# EAGLE schematic logicanalyzer_rev1 (EAGLE 4.16)

## Sheet 1 of 4
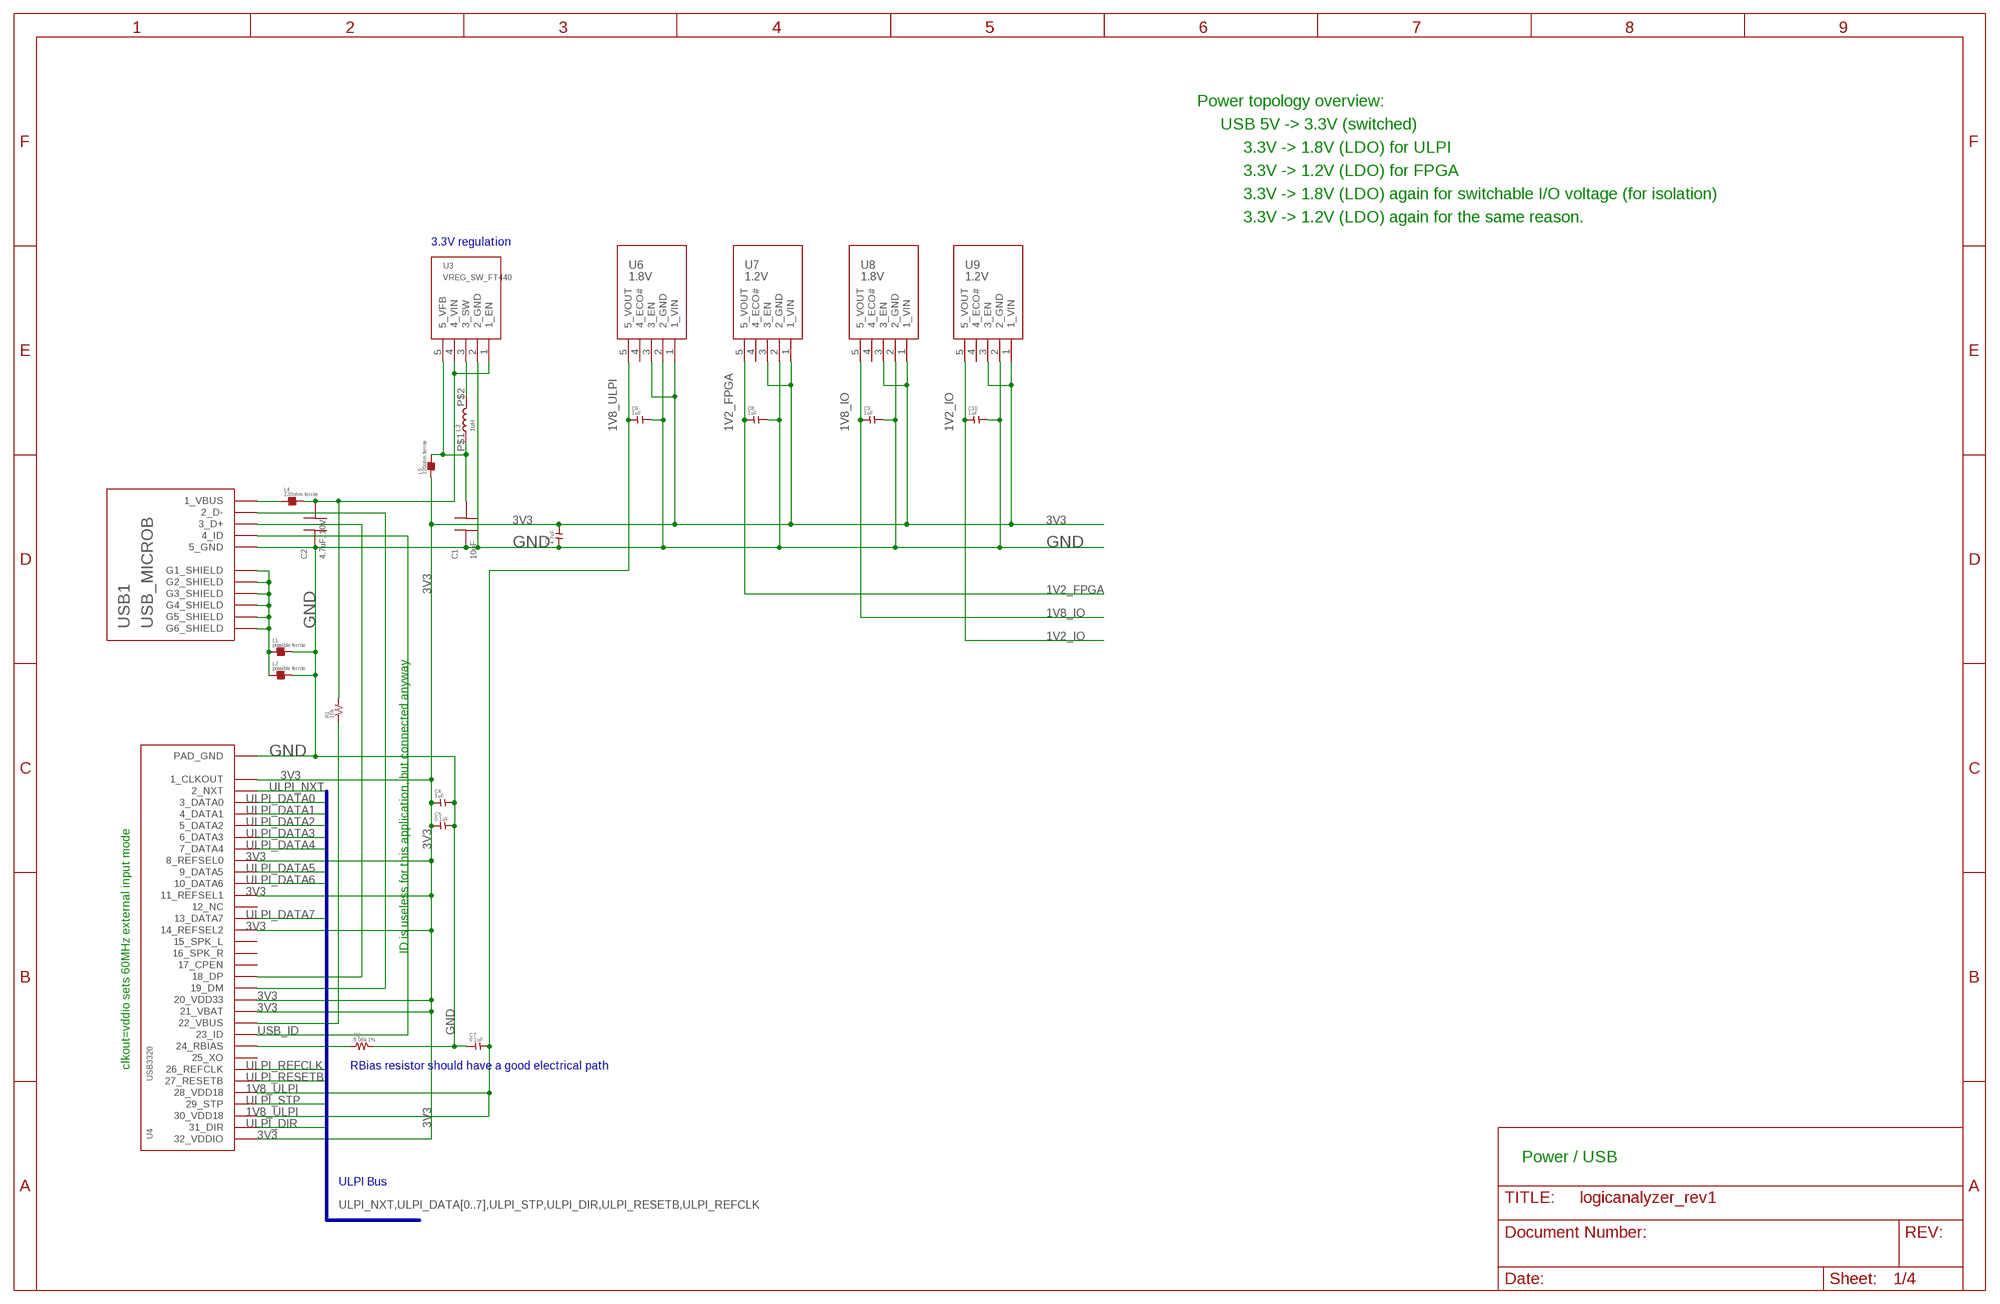
[diagram p0: schematic, sheet 1]

### Parts
C1  10uF  CAP0805  [SMD0805]
C2  4.7uF, 10V  CAP0805  [SMD0805]
C3  4.7uF  CAP0603  [0603]
C4  1uF  CAP0603  [0603]
C5  0.1uF  CAP0603  [0603]
C6  1uF  CAP0603  [0603]
C7  0.1uF  CAP0603  [0603]
C8  1uF  CAP0603  [0603]
C9  1uF  CAP0603  [0603]
C10  1uF  CAP0603  [0603]
L1  possible ferrite  FERRITE0603  [0603]
L2  possible ferrite  FERRITE0603  [0603]
L3  1uH  L_0805  [SMD0805]
L4  220ohm ferrite  FERRITE0603  [0603]
L5  220ohm ferrite  FERRITE0603  [0603]
R1  10k  RES0603  [0603]
R2  8.06k 1%  RES0603  [0603]
U3  VREG_SW_FT440  [SOT-23-5]
U4  USB3320  [QFG32PAD_.5MM_5X5]
U6  1.8V  VREG_LDO  [SOT-23-5]
U7  1.2V  VREG_LDO  [SOT-23-5]
U8  1.8V  VREG_LDO  [SOT-23-5]
U9  1.2V  VREG_LDO  [SOT-23-5]
USB1  USB_MICROB  [USB_MICROB_FEMALE_FCI_10103594]

### Nets
1V2_FPGA: C8.1 U7.5(5_VOUT) ; also sheet 3,4
1V2_IO: C10.1 U9.5(5_VOUT) ; also sheet 2
1V8_IO: C9.1 U8.5(5_VOUT) ; also sheet 2,4
1V8_ULPI: C6.1 C7.2 U4.28(28_VDD18) U4.30(30_VDD18) U6.5(5_VOUT)
3V3: C3.2 C4.1 C5.1 L5.1 U4.1(1_CLKOUT) U4.8(8_REFSEL0) U4.11(11_REFSEL1) U4.14(14_REFSEL2) U4.20(20_VDD33) U4.21(21_VBAT) U4.32(32_VDDIO) U6.1(1_VIN) U6.3(3_EN) U7.1(1_VIN) U7.3(3_EN) U8.1(1_VIN) U8.3(3_EN) U9.1(1_VIN) U9.3(3_EN) ; also sheet 2,3,4
GND: C1.P$1 C2.P$1 C3.1 C4.2 C5.2 C6.2 C7.1 C8.2 C9.2 C10.2 L1.2 L2.2 R2.2 U3.2(2_GND) U4.PAD(PAD_GND) U6.2(2_GND) U7.2(2_GND) U8.2(2_GND) U9.2(2_GND) USB1.5(5_GND) ; also sheet 2,3,4
N$1: L1.1 L2.1 USB1.G1(G1_SHIELD) USB1.G2(G2_SHIELD) USB1.G3(G3_SHIELD) USB1.G4(G4_SHIELD) USB1.G5(G5_SHIELD) USB1.G6(G6_SHIELD)
N$2: C2.P$2 L4.2 R1.2 U3.1(1_EN) U3.4(4_VIN)
N$3: U4.18(18_DP) USB1.3(3_D+)
N$4: U4.19(19_DM) USB1.2(2_D-)
N$5: R1.1 U4.22(22_VBUS)
N$6: L3.P$2 U3.3(3_SW)
N$7: L4.1 USB1.1(1_VBUS)
N$8: R2.1 U4.24(24_RBIAS)
N$9: C1.P$2 L3.P$1 L5.2 U3.5(5_VFB)
ULPI_DATA0: U4.3(3_DATA0) ; also sheet 4
ULPI_DATA1: U4.4(4_DATA1) ; also sheet 4
ULPI_DATA2: U4.5(5_DATA2) ; also sheet 4
ULPI_DATA3: U4.6(6_DATA3) ; also sheet 4
ULPI_DATA4: U4.7(7_DATA4) ; also sheet 4
ULPI_DATA5: U4.9(9_DATA5) ; also sheet 4
ULPI_DATA6: U4.10(10_DATA6) ; also sheet 4
ULPI_DATA7: U4.13(13_DATA7) ; also sheet 4
ULPI_DIR: U4.31(31_DIR) ; also sheet 4
ULPI_NXT: U4.2(2_NXT) ; also sheet 4
ULPI_REFCLK: U4.26(26_REFCLK) ; also sheet 4
ULPI_RESETB: U4.27(27_RESETB) ; also sheet 4
ULPI_STP: U4.29(29_STP) ; also sheet 4
USB_ID: U4.23(23_ID) USB1.4(4_ID)
Unconnected: U4.12(12_NC) U4.15(15_SPK_L) U4.16(16_SPK_R) U4.17(17_CPEN) U4.25(25_XO) U6.4(4_ECO#) U7.4(4_ECO#) U8.4(4_ECO#) U9.4(4_ECO#)

### Buses
ULPI_NXT,ULPI_DATA[0..7],ULPI_STP,ULPI_DIR,ULPI_RESETB,ULPI_REFCLK

### Notes on the sheet
- Power topology overview:
- USB 5V -> 3.3V (switched)
- 3.3V -> 1.8V (LDO) for ULPI
- 3.3V -> 1.2V (LDO) for FPGA
- 3.3V -> 1.8V (LDO) again for switchable I/O voltage (for isolation)
- 3.3V -> 1.2V (LDO) again for the same reason.
- 3.3V regulation
- ID is useless for this application, but connected anyway
- clkout=vddio sets 60MHz external input mode | RBias resistor should have a good electrical path
- Power / USB
- ULPI Bus

## Sheet 2 of 4
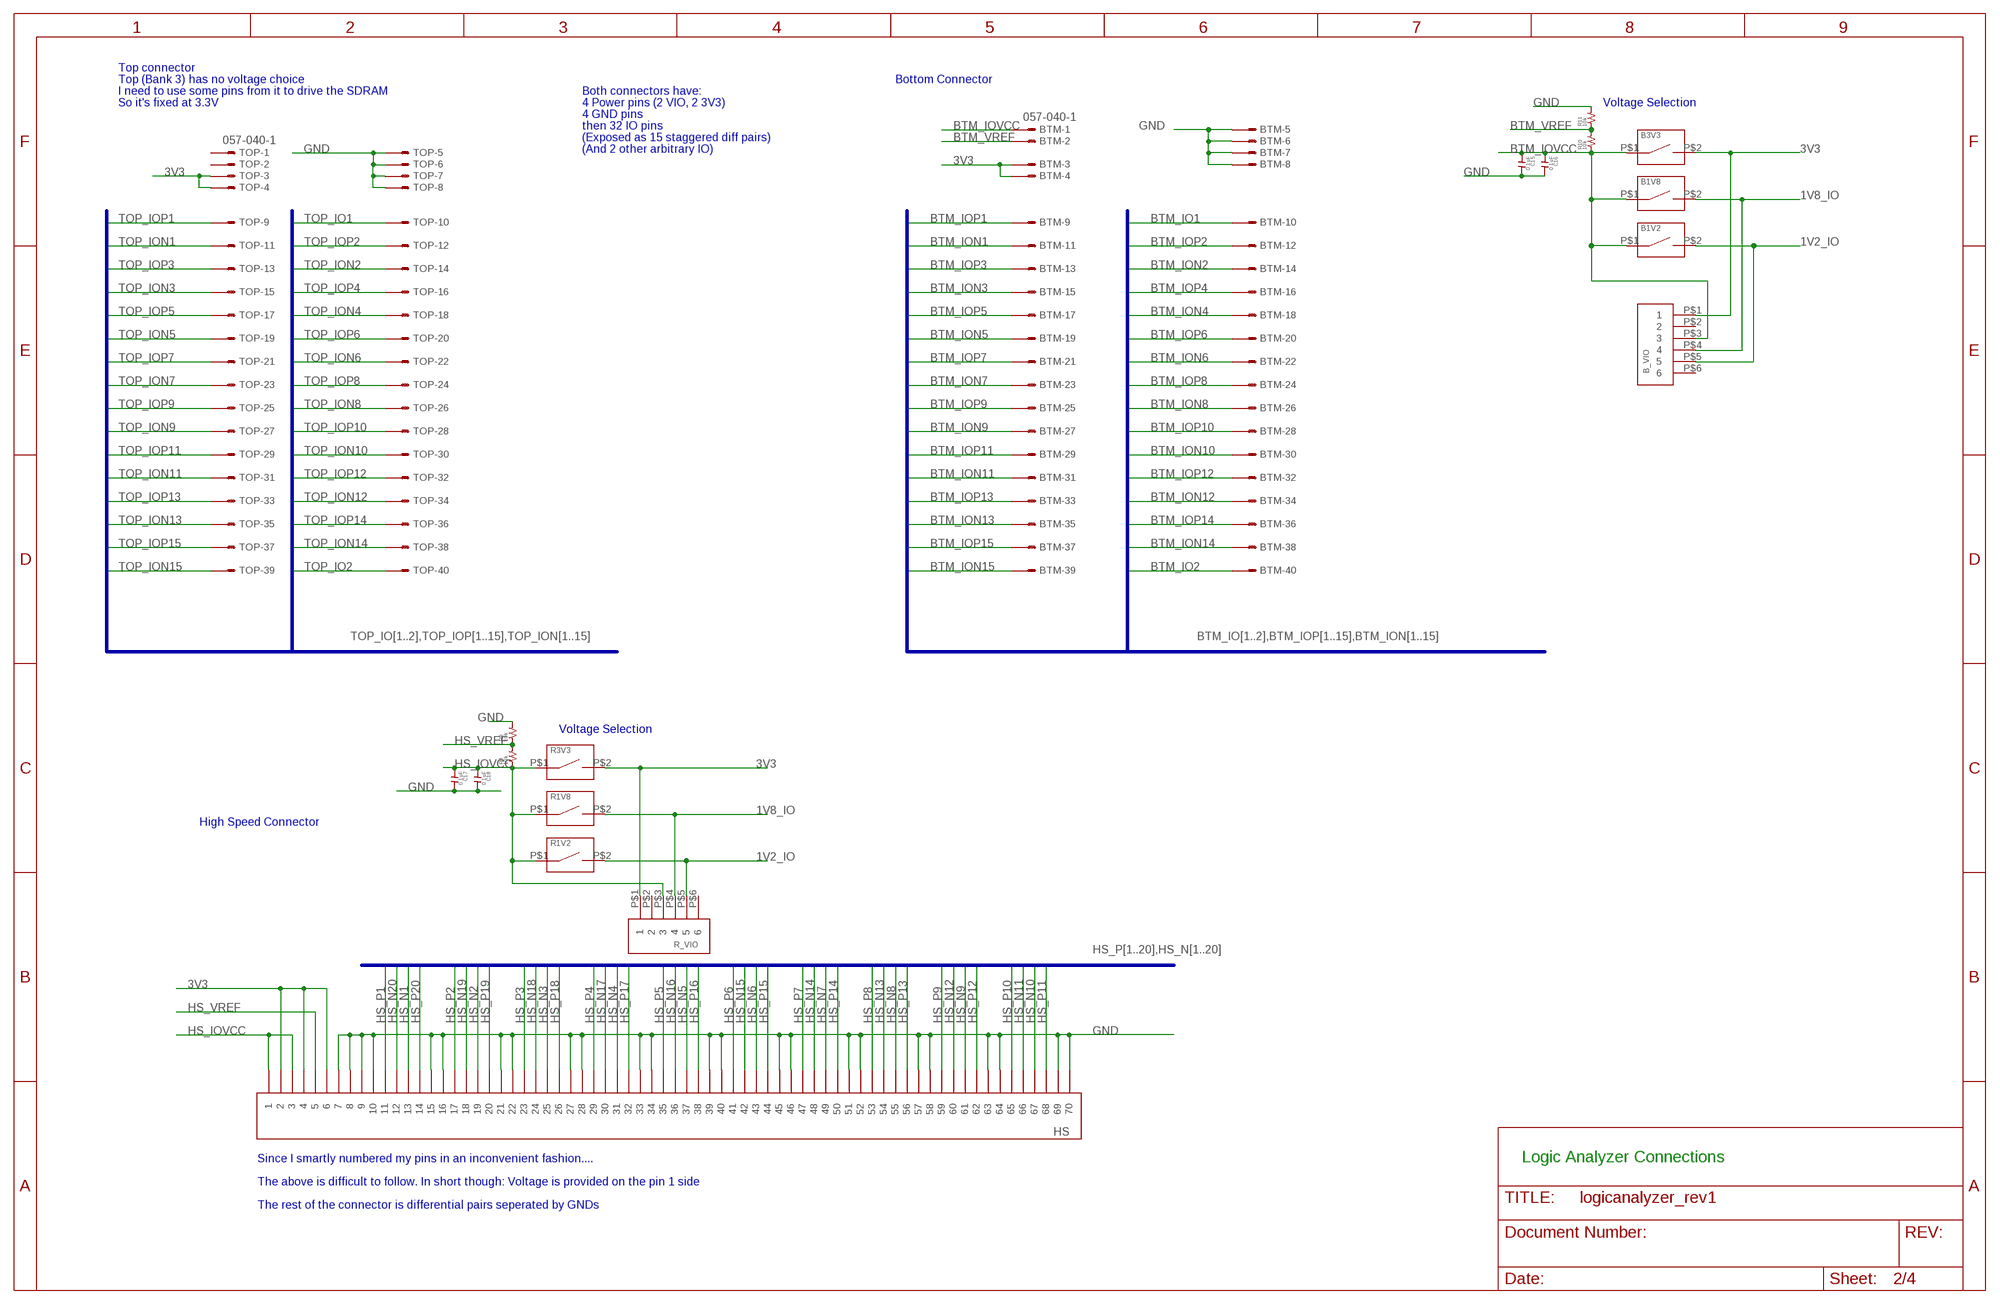
[diagram p1: schematic, sheet 2]

### Parts
B1V2  JUMPER2  [JUMPERPAD2]
B1V8  JUMPER2  [JUMPERPAD2]
B3V3  JUMPER2  [JUMPERPAD2]
B_VIO  HEADER_3X2  [HEADER_3X2]
BTM  057-040-1  [057-040-1]
C15  0.1uF  CAP0603  [0603]
C16  0.1uF  CAP0603  [0603]
C17  0.1uF  CAP0603  [0603]
C18  0.1uF  CAP0603  [0603]
HS  DF40_70BTM  [DF40_70_BTM]
R1V2  JUMPER2  [JUMPERPAD2]
R1V8  JUMPER2  [JUMPERPAD2]
R3V3  JUMPER2  [JUMPERPAD2]
R8  10k  RES0603  [0603]
R9  10k  RES0603  [0603]
R10  10k  RES0603  [0603]
R11  10k  RES0603  [0603]
R_VIO  HEADER_3X2  [HEADER_3X2]
TOP  057-040-1  [057-040-1]

### Nets
1V2_IO: B1V2.P$2 B_VIO.P$5 R1V2.P$2 R_VIO.P$5 ; also sheet 1
1V8_IO: B1V8.P$2 B_VIO.P$4 R1V8.P$2 R_VIO.P$4 ; also sheet 1,4
3V3: B3V3.P$2 B_VIO.P$1 BTM.3 BTM.4 HS.P$2 HS.P$4 HS.P$6 R3V3.P$2 R_VIO.P$1 TOP.3 TOP.4 ; also sheet 1,3,4
BTM_IO1: BTM.10 ; also sheet 4
BTM_IO2: BTM.40 ; also sheet 4
BTM_ION1: BTM.11 ; also sheet 4
BTM_ION2: BTM.14 ; also sheet 4
BTM_ION3: BTM.15 ; also sheet 4
BTM_ION4: BTM.18 ; also sheet 4
BTM_ION5: BTM.19 ; also sheet 4
BTM_ION6: BTM.22 ; also sheet 4
BTM_ION7: BTM.23 ; also sheet 4
BTM_ION8: BTM.26 ; also sheet 4
BTM_ION9: BTM.27 ; also sheet 4
BTM_ION10: BTM.30 ; also sheet 4
BTM_ION11: BTM.31 ; also sheet 4
BTM_ION12: BTM.34 ; also sheet 4
BTM_ION13: BTM.35 ; also sheet 4
BTM_ION14: BTM.38 ; also sheet 4
BTM_ION15: BTM.39 ; also sheet 4
BTM_IOP1: BTM.9 ; also sheet 4
BTM_IOP2: BTM.12 ; also sheet 4
BTM_IOP3: BTM.13 ; also sheet 4
BTM_IOP4: BTM.16 ; also sheet 4
BTM_IOP5: BTM.17 ; also sheet 4
BTM_IOP6: BTM.20 ; also sheet 4
BTM_IOP7: BTM.21 ; also sheet 4
BTM_IOP8: BTM.24 ; also sheet 4
BTM_IOP9: BTM.25 ; also sheet 4
BTM_IOP10: BTM.28 ; also sheet 4
BTM_IOP11: BTM.29 ; also sheet 4
BTM_IOP12: BTM.32 ; also sheet 4
BTM_IOP13: BTM.33 ; also sheet 4
BTM_IOP14: BTM.36 ; also sheet 4
BTM_IOP15: BTM.37 ; also sheet 4
BTM_IOVCC: B1V2.P$1 B1V8.P$1 B3V3.P$1 B_VIO.P$3 BTM.1 C15.1 C16.1 R10.1 ; also sheet 4
BTM_VREF: BTM.2 R10.2 R11.1 ; also sheet 4
GND: BTM.5 BTM.6 BTM.7 BTM.8 C15.2 C16.2 C17.2 C18.2 HS.P$7 HS.P$8 HS.P$9 HS.P$10 HS.P$15 HS.P$16 HS.P$21 HS.P$22 HS.P$27 HS.P$28 HS.P$33 HS.P$34 HS.P$39 HS.P$40 HS.P$45 HS.P$46 HS.P$51 HS.P$52 HS.P$57 HS.P$58 HS.P$63 HS.P$64 HS.P$69 HS.P$70 R9.2 R11.2 TOP.5 TOP.6 TOP.7 TOP.8 ; also sheet 1,3,4
HS_IOVCC: C17.1 C18.1 HS.P$1 HS.P$3 R1V2.P$1 R1V8.P$1 R3V3.P$1 R8.1 R_VIO.P$3 ; also sheet 4
HS_N1: HS.P$13 ; also sheet 4
HS_N2: HS.P$19 ; also sheet 4
HS_N3: HS.P$25 ; also sheet 4
HS_N4: HS.P$31 ; also sheet 4
HS_N5: HS.P$37 ; also sheet 4
HS_N6: HS.P$43 ; also sheet 4
HS_N7: HS.P$49 ; also sheet 4
HS_N8: HS.P$55 ; also sheet 4
HS_N9: HS.P$61 ; also sheet 4
HS_N10: HS.P$67 ; also sheet 4
HS_N11: HS.P$66 ; also sheet 4
HS_N12: HS.P$60 ; also sheet 4
HS_N13: HS.P$54 ; also sheet 4
HS_N14: HS.P$48 ; also sheet 4
HS_N15: HS.P$42 ; also sheet 4
HS_N16: HS.P$36 ; also sheet 4
HS_N17: HS.P$30 ; also sheet 4
HS_N18: HS.P$24 ; also sheet 4
HS_N19: HS.P$18
HS_N20: HS.P$12
HS_P1: HS.P$11 ; also sheet 4
HS_P2: HS.P$17 ; also sheet 4
HS_P3: HS.P$23 ; also sheet 4
HS_P4: HS.P$29 ; also sheet 4
HS_P5: HS.P$35 ; also sheet 4
HS_P6: HS.P$41 ; also sheet 4
HS_P7: HS.P$47 ; also sheet 4
HS_P8: HS.P$53 ; also sheet 4
HS_P9: HS.P$59 ; also sheet 4
HS_P10: HS.P$65 ; also sheet 4
HS_P11: HS.P$68 ; also sheet 4
HS_P12: HS.P$62 ; also sheet 4
HS_P13: HS.P$56 ; also sheet 4
HS_P14: HS.P$50 ; also sheet 4
HS_P15: HS.P$44 ; also sheet 4
HS_P16: HS.P$38 ; also sheet 4
HS_P17: HS.P$32 ; also sheet 4
HS_P18: HS.P$26 ; also sheet 4
HS_P19: HS.P$20 ; also sheet 4
HS_P20: HS.P$14
HS_VREF: HS.P$5 R8.2 R9.1 ; also sheet 4
TOP_IO1: TOP.10 ; also sheet 4
TOP_IO2: TOP.40 ; also sheet 4
TOP_ION1: TOP.11 ; also sheet 4
TOP_ION2: TOP.14 ; also sheet 4
TOP_ION3: TOP.15 ; also sheet 4
TOP_ION4: TOP.18 ; also sheet 4
TOP_ION5: TOP.19 ; also sheet 4
TOP_ION6: TOP.22 ; also sheet 4
TOP_ION7: TOP.23 ; also sheet 4
TOP_ION8: TOP.26 ; also sheet 4
TOP_ION9: TOP.27 ; also sheet 4
TOP_ION10: TOP.30 ; also sheet 4
TOP_ION11: TOP.31 ; also sheet 4
TOP_ION12: TOP.34 ; also sheet 4
TOP_ION13: TOP.35 ; also sheet 4
TOP_ION14: TOP.38 ; also sheet 4
TOP_ION15: TOP.39 ; also sheet 4
TOP_IOP1: TOP.9 ; also sheet 4
TOP_IOP2: TOP.12 ; also sheet 4
TOP_IOP3: TOP.13 ; also sheet 4
TOP_IOP4: TOP.16 ; also sheet 4
TOP_IOP5: TOP.17 ; also sheet 4
TOP_IOP6: TOP.20 ; also sheet 4
TOP_IOP7: TOP.21 ; also sheet 4
TOP_IOP8: TOP.24 ; also sheet 4
TOP_IOP9: TOP.25 ; also sheet 4
TOP_IOP10: TOP.28 ; also sheet 4
TOP_IOP11: TOP.29 ; also sheet 4
TOP_IOP12: TOP.32 ; also sheet 4
TOP_IOP13: TOP.33 ; also sheet 4
TOP_IOP14: TOP.36 ; also sheet 4
TOP_IOP15: TOP.37 ; also sheet 4
Unconnected: B_VIO.P$2 B_VIO.P$6 R_VIO.P$2 R_VIO.P$6 TOP.1 TOP.2

### Buses
TOP_IO[1..2],TOP_IOP[1..15],TOP_ION[1..15]
BTM_IO[1..2],BTM_IOP[1..15],BTM_ION[1..15]
HS_P[1..20],HS_N[1..20]

### Notes on the sheet
- Top connector
- Top (Bank 3) has no voltage choice | Bottom Connector
- I need to use some pins from it to drive the SDRAM | Both connectors have:
- So it's fixed at 3.3V | 4 Power pins (2 VIO, 2 3V3) | Voltage Selection
- 4 GND pins
- then 32 IO pins
- (Exposed as 15 staggered diff pairs)
- (And 2 other arbitrary IO)
- Voltage Selection
- High Speed Connector
- Since I smartly numbered my pins in an inconvenient fashion.... | Logic Analyzer Connections
- The above is difficult to follow. In short though: Voltage is provided on the pin 1 side
- The rest of the connector is differential pairs seperated by GNDs

## Sheet 3 of 4
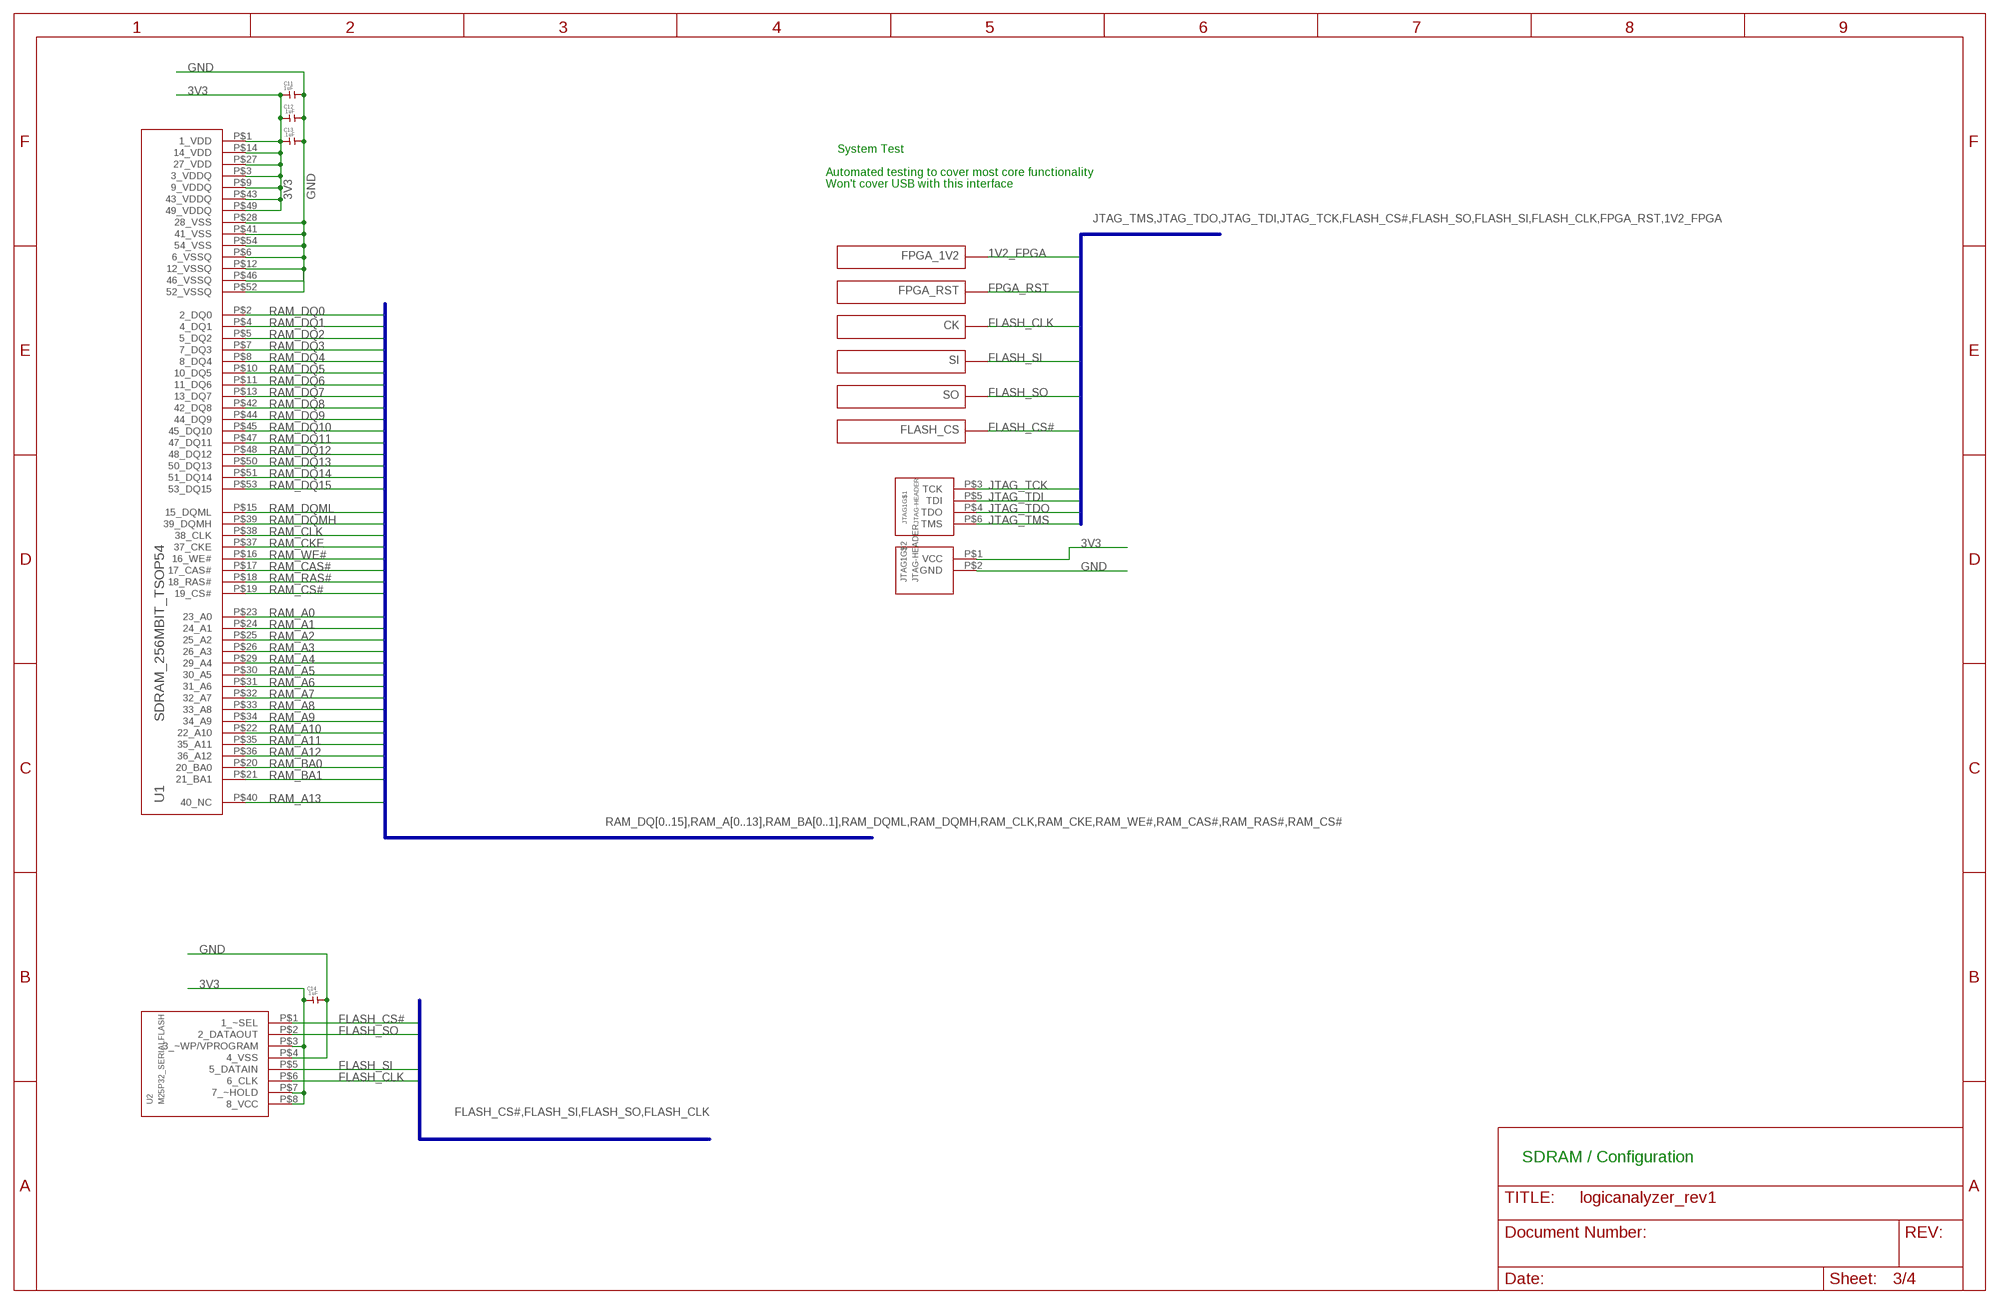
[diagram p2: schematic, sheet 3]

### Parts
C11  1uF  CAP0603  [0603]
C12  .1uF  CAP0603  [0603]
C13  .1uF  CAP0603  [0603]
C14  .1uF  CAP0603  [0603]
CK  PIN1.0MM  [PIN_1.0MM]
FLASH_CS  PIN1.0MM  [PIN_1.0MM]
FPGA_1V2  PIN1.0MM  [PIN_1.0MM]
FPGA_RST  PIN1.0MM  [PIN_1.0MM]
JTAG1  JTAG-HEADER  [JTAGHEADER6X1]
SI  PIN1.0MM  [PIN_1.0MM]
SO  PIN1.0MM  [PIN_1.0MM]
U1  SDRAM_256MBIT_TSOP54  [TSOP54_0.8MM_12X22]
U2  M25P32_SERIALFLASH  [SOIC-8-5.3MM]

### Nets
1V2_FPGA: FPGA_1V2.P$1 ; also sheet 1,4
3V3: C11.1 C12.1 C13.1 C14.1 JTAG1.P$1(VCC) U1.P$1(1_VDD) U1.P$3(3_VDDQ) U1.P$9(9_VDDQ) U1.P$14(14_VDD) U1.P$27(27_VDD) U1.P$43(43_VDDQ) U1.P$49(49_VDDQ) U2.P$3(3_~WP/VPROGRAM) U2.P$7(7_~HOLD) U2.P$8(8_VCC) ; also sheet 1,2,4
FLASH_CLK: CK.P$1 U2.P$6(6_CLK) ; also sheet 4
FLASH_CS#: FLASH_CS.P$1 U2.P$1(1_~SEL) ; also sheet 4
FLASH_SI: SI.P$1 U2.P$5(5_DATAIN) ; also sheet 4
FLASH_SO: SO.P$1 U2.P$2(2_DATAOUT) ; also sheet 4
FPGA_RST: FPGA_RST.P$1 ; also sheet 4
GND: C11.2 C12.2 C13.2 C14.2 JTAG1.P$2(GND) U1.P$6(6_VSSQ) U1.P$12(12_VSSQ) U1.P$28(28_VSS) U1.P$41(41_VSS) U1.P$46(46_VSSQ) U1.P$52(52_VSSQ) U1.P$54(54_VSS) U2.P$4(4_VSS) ; also sheet 1,2,4
JTAG_TCK: JTAG1.P$3(TCK) ; also sheet 4
JTAG_TDI: JTAG1.P$5(TDI) ; also sheet 4
JTAG_TDO: JTAG1.P$4(TDO) ; also sheet 4
JTAG_TMS: JTAG1.P$6(TMS) ; also sheet 4
RAM_A0: U1.P$23(23_A0) ; also sheet 4
RAM_A1: U1.P$24(24_A1) ; also sheet 4
RAM_A2: U1.P$25(25_A2) ; also sheet 4
RAM_A3: U1.P$26(26_A3) ; also sheet 4
RAM_A4: U1.P$29(29_A4) ; also sheet 4
RAM_A5: U1.P$30(30_A5) ; also sheet 4
RAM_A6: U1.P$31(31_A6) ; also sheet 4
RAM_A7: U1.P$32(32_A7) ; also sheet 4
RAM_A8: U1.P$33(33_A8) ; also sheet 4
RAM_A9: U1.P$34(34_A9) ; also sheet 4
RAM_A10: U1.P$22(22_A10) ; also sheet 4
RAM_A11: U1.P$35(35_A11) ; also sheet 4
RAM_A12: U1.P$36(36_A12) ; also sheet 4
RAM_A13: U1.P$40(40_NC) ; also sheet 4
RAM_BA0: U1.P$20(20_BA0) ; also sheet 4
RAM_BA1: U1.P$21(21_BA1) ; also sheet 4
RAM_CAS#: U1.P$17(17_CAS#) ; also sheet 4
RAM_CKE: U1.P$37(37_CKE) ; also sheet 4
RAM_CLK: U1.P$38(38_CLK) ; also sheet 4
RAM_CS#: U1.P$19(19_CS#) ; also sheet 4
RAM_DQ0: U1.P$2(2_DQ0) ; also sheet 4
RAM_DQ1: U1.P$4(4_DQ1) ; also sheet 4
RAM_DQ2: U1.P$5(5_DQ2) ; also sheet 4
RAM_DQ3: U1.P$7(7_DQ3) ; also sheet 4
RAM_DQ4: U1.P$8(8_DQ4) ; also sheet 4
RAM_DQ5: U1.P$10(10_DQ5) ; also sheet 4
RAM_DQ6: U1.P$11(11_DQ6) ; also sheet 4
RAM_DQ7: U1.P$13(13_DQ7) ; also sheet 4
RAM_DQ8: U1.P$42(42_DQ8) ; also sheet 4
RAM_DQ9: U1.P$44(44_DQ9) ; also sheet 4
RAM_DQ10: U1.P$45(45_DQ10) ; also sheet 4
RAM_DQ11: U1.P$47(47_DQ11) ; also sheet 4
RAM_DQ12: U1.P$48(48_DQ12) ; also sheet 4
RAM_DQ13: U1.P$50(50_DQ13) ; also sheet 4
RAM_DQ14: U1.P$51(51_DQ14) ; also sheet 4
RAM_DQ15: U1.P$53(53_DQ15) ; also sheet 4
RAM_DQMH: U1.P$39(39_DQMH) ; also sheet 4
RAM_DQML: U1.P$15(15_DQML) ; also sheet 4
RAM_RAS#: U1.P$18(18_RAS#) ; also sheet 4
RAM_WE#: U1.P$16(16_WE#) ; also sheet 4

### Buses
RAM_DQ[0..15],RAM_A[0..13],RAM_BA[0..1],RAM_DQML,RAM_DQMH,RAM_CLK,RAM_CKE,RAM_WE#,RAM_CAS#,RAM_RAS#,RAM_CS#
FLASH_CS#,FLASH_SI,FLASH_SO,FLASH_CLK
JTAG_TMS,JTAG_TDO,JTAG_TDI,JTAG_TCK,FLASH_CS#,FLASH_SO,FLASH_SI,FLASH_CLK,FPGA_RST,1V2_FPGA

### Notes on the sheet
- System Test
- Automated testing to cover most core functionality
- Won't cover USB with this interface
- SDRAM / Configuration

## Sheet 4 of 4
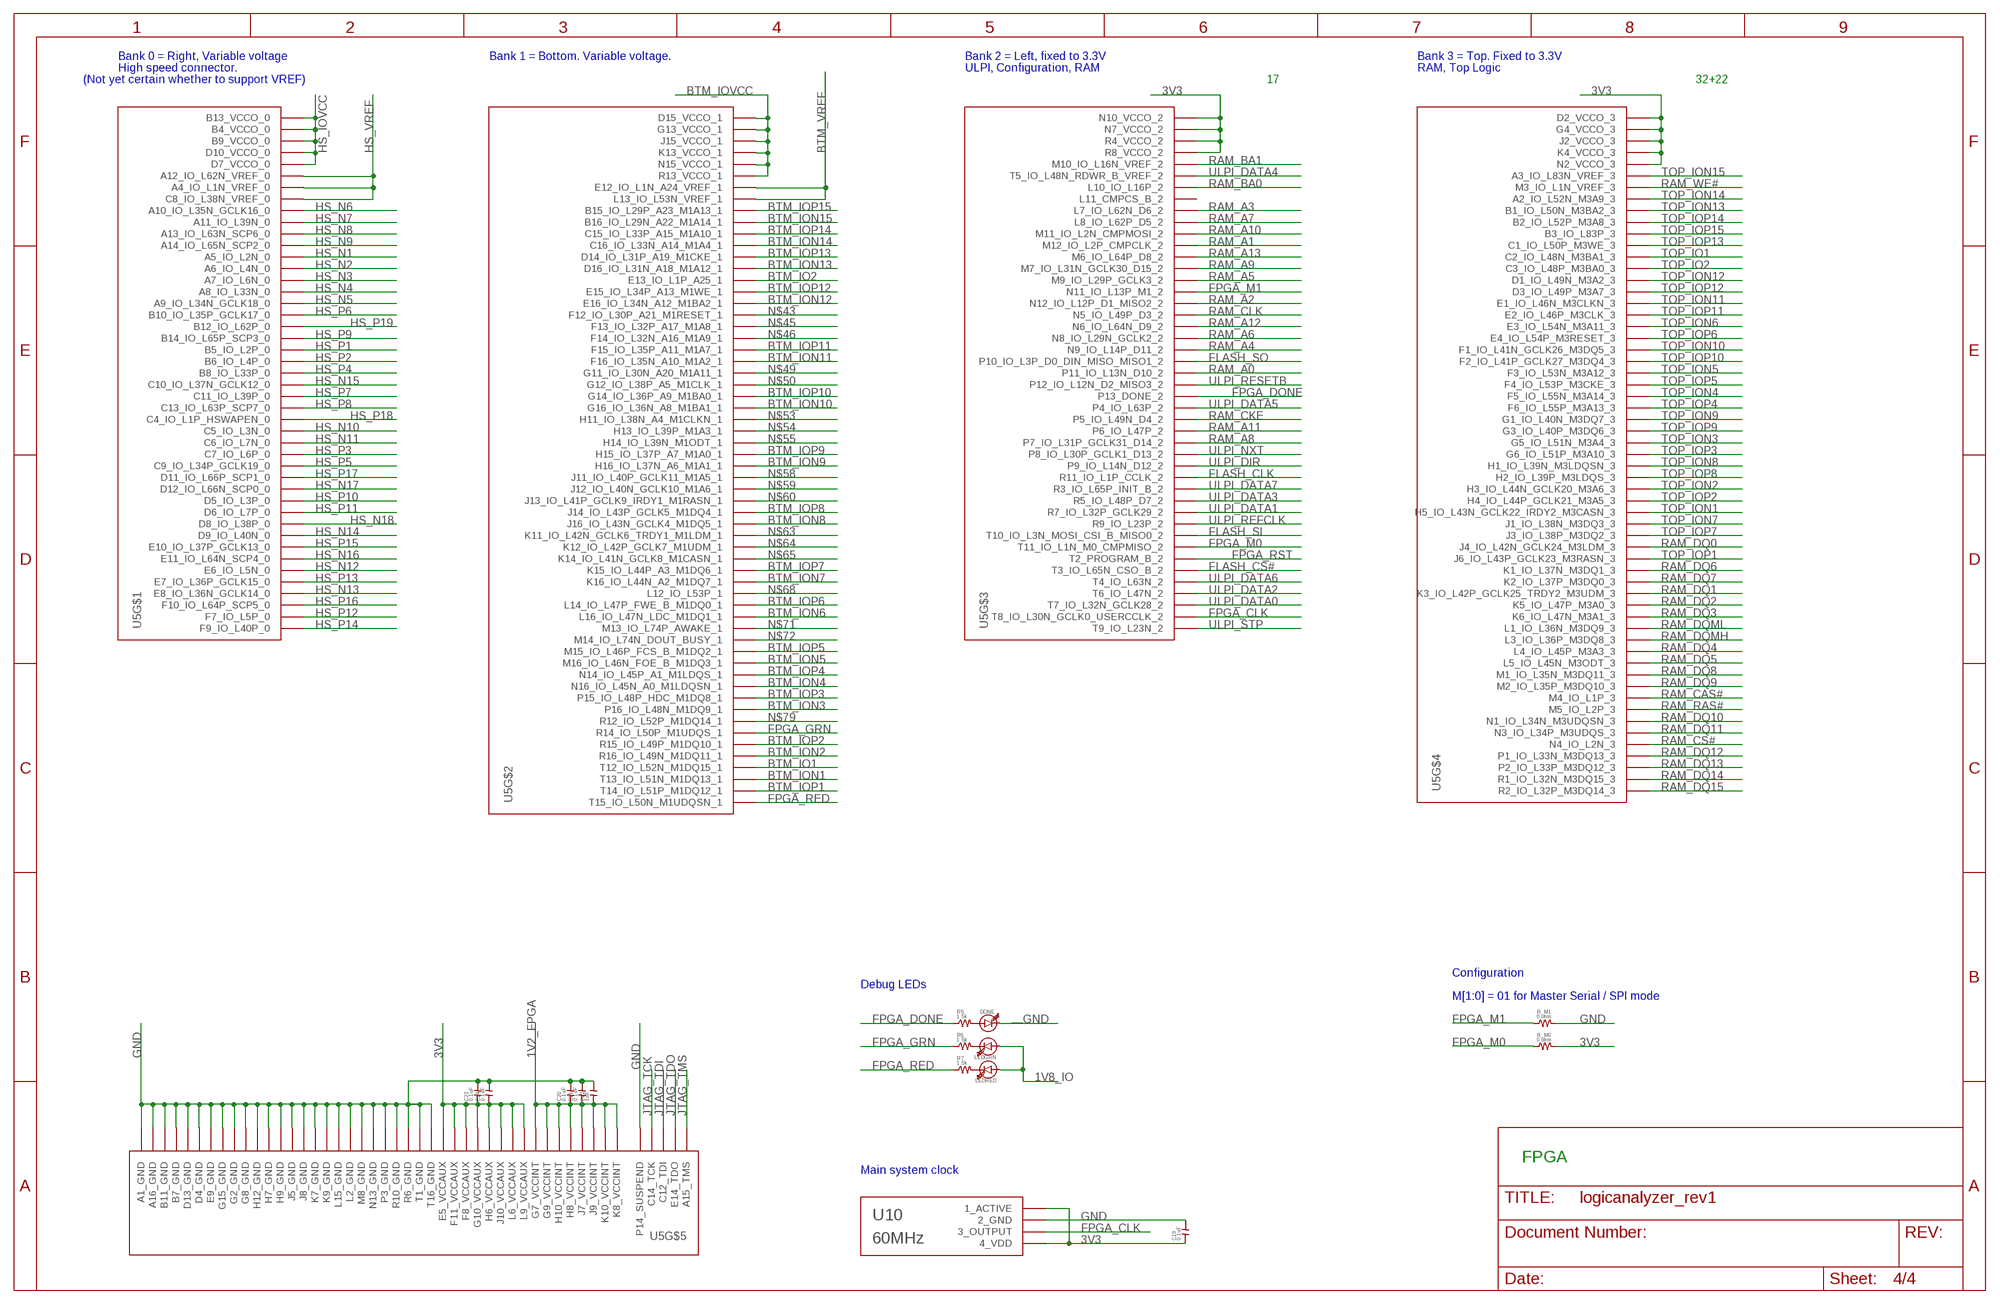
[diagram p3: schematic, sheet 4]

### Parts
C19  0.1uF  CAP0603  [0603]
C20  0.1uF  CAP0603  [0603]
C21  0.1uF  CAP0603  [0603]
C22  1uF  CAP0603  [0603]
C23  0.1uF  CAP0603  [0603]
C24  0.1uF  CAP0603  [0603]
DONE  LED0603  [0603_DIODE]
LEDGRN  LED0603  [0603_DIODE]
LEDRED  LED0603  [0603_DIODE]
R5  1.5k  RES0603  [0603]
R6  1.5k  RES0603  [0603]
R7  1.5k  RES0603  [0603]
R_M0  0 ohm  RES0603  [0603]
R_M1  0 ohm  RES0603  [0603]
U5  SPARTAN6-FT256  [FG256_1MM_17X17]
U10  60MHz  OSCASDMB  [ASDMB_2X2.5]

### Nets
1V2_FPGA: C20.1 C21.1 C22.1 U5.G7(G7_VCCINT) U5.G9(G9_VCCINT) U5.H8(H8_VCCINT) U5.H10(H10_VCCINT) U5.J7(J7_VCCINT) U5.J9(J9_VCCINT) U5.K8(K8_VCCINT) U5.K10(K10_VCCINT) ; also sheet 1,3
1V8_IO: LEDGRN.+ LEDRED.+ ; also sheet 1,2
3V3: C19.1 C23.1 C24.1 R_M0.2 U5.D2(D2_VCCO_3) U5.E5(E5_VCCAUX) U5.F8(F8_VCCAUX) U5.F11(F11_VCCAUX) U5.G4(G4_VCCO_3) U5.G10(G10_VCCAUX) U5.H6(H6_VCCAUX) U5.J2(J2_VCCO_3) U5.J10(J10_VCCAUX) U5.K4(K4_VCCO_3) U5.L6(L6_VCCAUX) U5.L9(L9_VCCAUX) U5.N2(N2_VCCO_3) U5.N7(N7_VCCO_2) U5.N10(N10_VCCO_2) U5.R4(R4_VCCO_2) U5.R8(R8_VCCO_2) U10.1(1_ACTIVE) U10.4(4_VDD) ; also sheet 1,2,3
BTM_IO1: U5.T12(T12_IO_L52N_M1DQ15_1) ; also sheet 2
BTM_IO2: U5.E13(E13_IO_L1P_A25_1) ; also sheet 2
BTM_ION1: U5.T13(T13_IO_L51N_M1DQ13_1) ; also sheet 2
BTM_ION2: U5.R16(R16_IO_L49N_M1DQ11_1) ; also sheet 2
BTM_ION3: U5.P16(P16_IO_L48N_M1DQ9_1) ; also sheet 2
BTM_ION4: U5.N16(N16_IO_L45N_A0_M1LDQSN_1) ; also sheet 2
BTM_ION5: U5.M16(M16_IO_L46N_FOE_B_M1DQ3_1) ; also sheet 2
BTM_ION6: U5.L16(L16_IO_L47N_LDC_M1DQ1_1) ; also sheet 2
BTM_ION7: U5.K16(K16_IO_L44N_A2_M1DQ7_1) ; also sheet 2
BTM_ION8: U5.J16(J16_IO_L43N_GCLK4_M1DQ5_1) ; also sheet 2
BTM_ION9: U5.H16(H16_IO_L37N_A6_M1A1_1) ; also sheet 2
BTM_ION10: U5.G16(G16_IO_L36N_A8_M1BA1_1) ; also sheet 2
BTM_ION11: U5.F16(F16_IO_L35N_A10_M1A2_1) ; also sheet 2
BTM_ION12: U5.E16(E16_IO_L34N_A12_M1BA2_1) ; also sheet 2
BTM_ION13: U5.D16(D16_IO_L31N_A18_M1A12_1) ; also sheet 2
BTM_ION14: U5.C16(C16_IO_L33N_A14_M1A4_1) ; also sheet 2
BTM_ION15: U5.B16(B16_IO_L29N_A22_M1A14_1) ; also sheet 2
BTM_IOP1: U5.T14(T14_IO_L51P_M1DQ12_1) ; also sheet 2
BTM_IOP2: U5.R15(R15_IO_L49P_M1DQ10_1) ; also sheet 2
BTM_IOP3: U5.P15(P15_IO_L48P_HDC_M1DQ8_1) ; also sheet 2
BTM_IOP4: U5.N14(N14_IO_L45P_A1_M1LDQS_1) ; also sheet 2
BTM_IOP5: U5.M15(M15_IO_L46P_FCS_B_M1DQ2_1) ; also sheet 2
BTM_IOP6: U5.L14(L14_IO_L47P_FWE_B_M1DQ0_1) ; also sheet 2
BTM_IOP7: U5.K15(K15_IO_L44P_A3_M1DQ6_1) ; also sheet 2
BTM_IOP8: U5.J14(J14_IO_L43P_GCLK5_M1DQ4_1) ; also sheet 2
BTM_IOP9: U5.H15(H15_IO_L37P_A7_M1A0_1) ; also sheet 2
BTM_IOP10: U5.G14(G14_IO_L36P_A9_M1BA0_1) ; also sheet 2
BTM_IOP11: U5.F15(F15_IO_L35P_A11_M1A7_1) ; also sheet 2
BTM_IOP12: U5.E15(E15_IO_L34P_A13_M1WE_1) ; also sheet 2
BTM_IOP13: U5.D14(D14_IO_L31P_A19_M1CKE_1) ; also sheet 2
BTM_IOP14: U5.C15(C15_IO_L33P_A15_M1A10_1) ; also sheet 2
BTM_IOP15: U5.B15(B15_IO_L29P_A23_M1A13_1) ; also sheet 2
BTM_IOVCC: U5.D15(D15_VCCO_1) U5.G13(G13_VCCO_1) U5.J15(J15_VCCO_1) U5.K13(K13_VCCO_1) U5.N15(N15_VCCO_1) U5.R13(R13_VCCO_1) ; also sheet 2
BTM_VREF: U5.E12(E12_IO_L1N_A24_VREF_1) U5.L13(L13_IO_L53N_VREF_1) ; also sheet 2
FLASH_CLK: U5.R11(R11_IO_L1P_CCLK_2) ; also sheet 3
FLASH_CS#: U5.T3(T3_IO_L65N_CSO_B_2) ; also sheet 3
FLASH_SI: U5.T10(T10_IO_L3N_MOSI_CSI_B_MISO0_2) ; also sheet 3
FLASH_SO: U5.P10(P10_IO_L3P_D0_DIN_MISO_MISO1_2) ; also sheet 3
FPGA_CLK: U5.T8(T8_IO_L30N_GCLK0_USERCCLK_2) U10.3(3_OUTPUT)
FPGA_DONE: R5.1 U5.P13(P13_DONE_2)
FPGA_GRN: R6.1 U5.R14(R14_IO_L50P_M1UDQS_1)
FPGA_M0: R_M0.1 U5.T11(T11_IO_L1N_M0_CMPMISO_2)
FPGA_M1: R_M1.1 U5.N11(N11_IO_L13P_M1_2)
FPGA_RED: R7.1 U5.T15(T15_IO_L50N_M1UDQSN_1)
FPGA_RST: U5.T2(T2_PROGRAM_B_2) ; also sheet 3
GND: C19.2 C20.2 C21.2 C22.2 C23.2 C24.2 DONE.- R_M1.2 U5.A1(A1_GND) U5.A16(A16_GND) U5.B7(B7_GND) U5.B11(B11_GND) U5.D4(D4_GND) U5.D13(D13_GND) U5.E9(E9_GND) U5.G2(G2_GND) U5.G8(G8_GND) U5.G15(G15_GND) U5.H7(H7_GND) U5.H9(H9_GND) U5.H12(H12_GND) U5.J5(J5_GND) U5.J8(J8_GND) U5.K7(K7_GND) U5.K9(K9_GND) U5.L2(L2_GND) U5.L15(L15_GND) U5.M8(M8_GND) U5.N13(N13_GND) U5.P3(P3_GND) U5.P14(P14_SUSPEND) U5.R6(R6_GND) U5.R10(R10_GND) U5.T1(T1_GND) U5.T16(T16_GND) U10.2(2_GND) ; also sheet 1,2,3
HS_IOVCC: U5.B4(B4_VCCO_0) U5.B9(B9_VCCO_0) U5.B13(B13_VCCO_0) U5.D7(D7_VCCO_0) U5.D10(D10_VCCO_0) ; also sheet 2
HS_N1: U5.A5(A5_IO_L2N_0) ; also sheet 2
HS_N2: U5.A6(A6_IO_L4N_0) ; also sheet 2
HS_N3: U5.A7(A7_IO_L6N_0) ; also sheet 2
HS_N4: U5.A8(A8_IO_L33N_0) ; also sheet 2
HS_N5: U5.A9(A9_IO_L34N_GCLK18_0) ; also sheet 2
HS_N6: U5.A10(A10_IO_L35N_GCLK16_0) ; also sheet 2
HS_N7: U5.A11(A11_IO_L39N_0) ; also sheet 2
HS_N8: U5.A13(A13_IO_L63N_SCP6_0) ; also sheet 2
HS_N9: U5.A14(A14_IO_L65N_SCP2_0) ; also sheet 2
HS_N10: U5.C5(C5_IO_L3N_0) ; also sheet 2
HS_N11: U5.C6(C6_IO_L7N_0) ; also sheet 2
HS_N12: U5.E6(E6_IO_L5N_0) ; also sheet 2
HS_N13: U5.E8(E8_IO_L36N_GCLK14_0) ; also sheet 2
HS_N14: U5.D9(D9_IO_L40N_0) ; also sheet 2
HS_N15: U5.C10(C10_IO_L37N_GCLK12_0) ; also sheet 2
HS_N16: U5.E11(E11_IO_L64N_SCP4_0) ; also sheet 2
HS_N17: U5.D12(D12_IO_L66N_SCP0_0) ; also sheet 2
HS_N18: U5.D8(D8_IO_L38P_0) ; also sheet 2
HS_P1: U5.B5(B5_IO_L2P_0) ; also sheet 2
HS_P2: U5.B6(B6_IO_L4P_0) ; also sheet 2
HS_P3: U5.C7(C7_IO_L6P_0) ; also sheet 2
HS_P4: U5.B8(B8_IO_L33P_0) ; also sheet 2
HS_P5: U5.C9(C9_IO_L34P_GCLK19_0) ; also sheet 2
HS_P6: U5.B10(B10_IO_L35P_GCLK17_0) ; also sheet 2
HS_P7: U5.C11(C11_IO_L39P_0) ; also sheet 2
HS_P8: U5.C13(C13_IO_L63P_SCP7_0) ; also sheet 2
HS_P9: U5.B14(B14_IO_L65P_SCP3_0) ; also sheet 2
HS_P10: U5.D5(D5_IO_L3P_0) ; also sheet 2
HS_P11: U5.D6(D6_IO_L7P_0) ; also sheet 2
HS_P12: U5.F7(F7_IO_L5P_0) ; also sheet 2
HS_P13: U5.E7(E7_IO_L36P_GCLK15_0) ; also sheet 2
HS_P14: U5.F9(F9_IO_L40P_0) ; also sheet 2
HS_P15: U5.E10(E10_IO_L37P_GCLK13_0) ; also sheet 2
HS_P16: U5.F10(F10_IO_L64P_SCP5_0) ; also sheet 2
HS_P17: U5.D11(D11_IO_L66P_SCP1_0) ; also sheet 2
HS_P18: U5.C4(C4_IO_L1P_HSWAPEN_0) ; also sheet 2
HS_P19: U5.B12(B12_IO_L62P_0) ; also sheet 2
HS_VREF: U5.A4(A4_IO_L1N_VREF_0) U5.A12(A12_IO_L62N_VREF_0) U5.C8(C8_IO_L38N_VREF_0) ; also sheet 2
JTAG_TCK: U5.C14(C14_TCK) ; also sheet 3
JTAG_TDI: U5.C12(C12_TDI) ; also sheet 3
JTAG_TDO: U5.E14(E14_TDO) ; also sheet 3
JTAG_TMS: U5.A15(A15_TMS) ; also sheet 3
N$13: DONE.+ R5.2
N$14: LEDGRN.- R6.2
N$15: LEDRED.- R7.2
N$43: U5.F12(F12_IO_L30P_A21_M1RESET_1)
N$45: U5.F13(F13_IO_L32P_A17_M1A8_1)
N$46: U5.F14(F14_IO_L32N_A16_M1A9_1)
N$49: U5.G11(G11_IO_L30N_A20_M1A11_1)
N$50: U5.G12(G12_IO_L38P_A5_M1CLK_1)
N$53: U5.H11(H11_IO_L38N_A4_M1CLKN_1)
N$54: U5.H13(H13_IO_L39P_M1A3_1)
N$55: U5.H14(H14_IO_L39N_M1ODT_1)
N$58: U5.J11(J11_IO_L40P_GCLK11_M1A5_1)
N$59: U5.J12(J12_IO_L40N_GCLK10_M1A6_1)
N$60: U5.J13(J13_IO_L41P_GCLK9_IRDY1_M1RASN_1)
N$63: U5.K11(K11_IO_L42N_GCLK6_TRDY1_M1LDM_1)
N$64: U5.K12(K12_IO_L42P_GCLK7_M1UDM_1)
N$65: U5.K14(K14_IO_L41N_GCLK8_M1CASN_1)
N$68: U5.L12(L12_IO_L53P_1)
N$71: U5.M13(M13_IO_L74P_AWAKE_1)
N$72: U5.M14(M14_IO_L74N_DOUT_BUSY_1)
N$79: U5.R12(R12_IO_L52P_M1DQ14_1)
RAM_A0: U5.P11(P11_IO_L13N_D10_2) ; also sheet 3
RAM_A1: U5.M12(M12_IO_L2P_CMPCLK_2) ; also sheet 3
RAM_A2: U5.N12(N12_IO_L12P_D1_MISO2_2) ; also sheet 3
RAM_A3: U5.L7(L7_IO_L62N_D6_2) ; also sheet 3
RAM_A4: U5.N9(N9_IO_L14P_D11_2) ; also sheet 3
RAM_A5: U5.M9(M9_IO_L29P_GCLK3_2) ; also sheet 3
RAM_A6: U5.N8(N8_IO_L29N_GCLK2_2) ; also sheet 3
RAM_A7: U5.L8(L8_IO_L62P_D5_2) ; also sheet 3
RAM_A8: U5.P7(P7_IO_L31P_GCLK31_D14_2) ; also sheet 3
RAM_A9: U5.M7(M7_IO_L31N_GCLK30_D15_2) ; also sheet 3
RAM_A10: U5.M11(M11_IO_L2N_CMPMOSI_2) ; also sheet 3
RAM_A11: U5.P6(P6_IO_L47P_2) ; also sheet 3
RAM_A12: U5.N6(N6_IO_L64N_D9_2) ; also sheet 3
RAM_A13: U5.M6(M6_IO_L64P_D8_2) ; also sheet 3
RAM_BA0: U5.L10(L10_IO_L16P_2) ; also sheet 3
RAM_BA1: U5.M10(M10_IO_L16N_VREF_2) ; also sheet 3
RAM_CAS#: U5.M4(M4_IO_L1P_3) ; also sheet 3
RAM_CKE: U5.P5(P5_IO_L49N_D4_2) ; also sheet 3
RAM_CLK: U5.N5(N5_IO_L49P_D3_2) ; also sheet 3
RAM_CS#: U5.N4(N4_IO_L2N_3) ; also sheet 3
RAM_DQ0: U5.J4(J4_IO_L42N_GCLK24_M3LDM_3) ; also sheet 3
RAM_DQ1: U5.K3(K3_IO_L42P_GCLK25_TRDY2_M3UDM_3) ; also sheet 3
RAM_DQ2: U5.K5(K5_IO_L47P_M3A0_3) ; also sheet 3
RAM_DQ3: U5.K6(K6_IO_L47N_M3A1_3) ; also sheet 3
RAM_DQ4: U5.L4(L4_IO_L45P_M3A3_3) ; also sheet 3
RAM_DQ5: U5.L5(L5_IO_L45N_M3ODT_3) ; also sheet 3
RAM_DQ6: U5.K1(K1_IO_L37N_M3DQ1_3) ; also sheet 3
RAM_DQ7: U5.K2(K2_IO_L37P_M3DQ0_3) ; also sheet 3
RAM_DQ8: U5.M1(M1_IO_L35N_M3DQ11_3) ; also sheet 3
RAM_DQ9: U5.M2(M2_IO_L35P_M3DQ10_3) ; also sheet 3
RAM_DQ10: U5.N1(N1_IO_L34N_M3UDQSN_3) ; also sheet 3
RAM_DQ11: U5.N3(N3_IO_L34P_M3UDQS_3) ; also sheet 3
RAM_DQ12: U5.P1(P1_IO_L33N_M3DQ13_3) ; also sheet 3
RAM_DQ13: U5.P2(P2_IO_L33P_M3DQ12_3) ; also sheet 3
RAM_DQ14: U5.R1(R1_IO_L32N_M3DQ15_3) ; also sheet 3
RAM_DQ15: U5.R2(R2_IO_L32P_M3DQ14_3) ; also sheet 3
RAM_DQMH: U5.L3(L3_IO_L36P_M3DQ8_3) ; also sheet 3
RAM_DQML: U5.L1(L1_IO_L36N_M3DQ9_3) ; also sheet 3
RAM_RAS#: U5.M5(M5_IO_L2P_3) ; also sheet 3
RAM_WE#: U5.M3(M3_IO_L1N_VREF_3) ; also sheet 3
TOP_IO1: U5.C2(C2_IO_L48N_M3BA1_3) ; also sheet 2
TOP_IO2: U5.C3(C3_IO_L48P_M3BA0_3) ; also sheet 2
TOP_ION1: U5.H5(H5_IO_L43N_GCLK22_IRDY2_M3CASN_3) ; also sheet 2
TOP_ION2: U5.H3(H3_IO_L44N_GCLK20_M3A6_3) ; also sheet 2
TOP_ION3: U5.G5(G5_IO_L51N_M3A4_3) ; also sheet 2
TOP_ION4: U5.F5(F5_IO_L55N_M3A14_3) ; also sheet 2
TOP_ION5: U5.F3(F3_IO_L53N_M3A12_3) ; also sheet 2
TOP_ION6: U5.E3(E3_IO_L54N_M3A11_3) ; also sheet 2
TOP_ION7: U5.J1(J1_IO_L38N_M3DQ3_3) ; also sheet 2
TOP_ION8: U5.H1(H1_IO_L39N_M3LDQSN_3) ; also sheet 2
TOP_ION9: U5.G1(G1_IO_L40N_M3DQ7_3) ; also sheet 2
TOP_ION10: U5.F1(F1_IO_L41N_GCLK26_M3DQ5_3) ; also sheet 2
TOP_ION11: U5.E1(E1_IO_L46N_M3CLKN_3) ; also sheet 2
TOP_ION12: U5.D1(D1_IO_L49N_M3A2_3) ; also sheet 2
TOP_ION13: U5.B1(B1_IO_L50N_M3BA2_3) ; also sheet 2
TOP_ION14: U5.A2(A2_IO_L52N_M3A9_3) ; also sheet 2
TOP_ION15: U5.A3(A3_IO_L83N_VREF_3) ; also sheet 2
TOP_IOP1: U5.J6(J6_IO_L43P_GCLK23_M3RASN_3) ; also sheet 2
TOP_IOP2: U5.H4(H4_IO_L44P_GCLK21_M3A5_3) ; also sheet 2
TOP_IOP3: U5.G6(G6_IO_L51P_M3A10_3) ; also sheet 2
TOP_IOP4: U5.F6(F6_IO_L55P_M3A13_3) ; also sheet 2
TOP_IOP5: U5.F4(F4_IO_L53P_M3CKE_3) ; also sheet 2
TOP_IOP6: U5.E4(E4_IO_L54P_M3RESET_3) ; also sheet 2
TOP_IOP7: U5.J3(J3_IO_L38P_M3DQ2_3) ; also sheet 2
TOP_IOP8: U5.H2(H2_IO_L39P_M3LDQS_3) ; also sheet 2
TOP_IOP9: U5.G3(G3_IO_L40P_M3DQ6_3) ; also sheet 2
TOP_IOP10: U5.F2(F2_IO_L41P_GCLK27_M3DQ4_3) ; also sheet 2
TOP_IOP11: U5.E2(E2_IO_L46P_M3CLK_3) ; also sheet 2
TOP_IOP12: U5.D3(D3_IO_L49P_M3A7_3) ; also sheet 2
TOP_IOP13: U5.C1(C1_IO_L50P_M3WE_3) ; also sheet 2
TOP_IOP14: U5.B2(B2_IO_L52P_M3A8_3) ; also sheet 2
TOP_IOP15: U5.B3(B3_IO_L83P_3) ; also sheet 2
ULPI_DATA0: U5.T7(T7_IO_L32N_GCLK28_2) ; also sheet 1
ULPI_DATA1: U5.R7(R7_IO_L32P_GCLK29_2) ; also sheet 1
ULPI_DATA2: U5.T6(T6_IO_L47N_2) ; also sheet 1
ULPI_DATA3: U5.R5(R5_IO_L48P_D7_2) ; also sheet 1
ULPI_DATA4: U5.T5(T5_IO_L48N_RDWR_B_VREF_2) ; also sheet 1
ULPI_DATA5: U5.P4(P4_IO_L63P_2) ; also sheet 1
ULPI_DATA6: U5.T4(T4_IO_L63N_2) ; also sheet 1
ULPI_DATA7: U5.R3(R3_IO_L65P_INIT_B_2) ; also sheet 1
ULPI_DIR: U5.P9(P9_IO_L14N_D12_2) ; also sheet 1
ULPI_NXT: U5.P8(P8_IO_L30P_GCLK1_D13_2) ; also sheet 1
ULPI_REFCLK: U5.R9(R9_IO_L23P_2) ; also sheet 1
ULPI_RESETB: U5.P12(P12_IO_L12N_D2_MISO3_2) ; also sheet 1
ULPI_STP: U5.T9(T9_IO_L23N_2) ; also sheet 1
Unconnected: U5.L11(L11_CMPCS_B_2)

### Notes on the sheet
- Bank 0 = Right, Variable voltage | Bank 1 = Bottom. Variable voltage. | Bank 2 = Left, fixed to 3.3V | Bank 3 = Top. Fixed to 3.3V
- High speed connector. | ULPI, Configuration, RAM | RAM, Top Logic
- (Not yet certain whether to support VREF) | 17 | 32+22
- Configuration
- Debug LEDs
- M[1:0] = 01 for Master Serial / SPI mode
- FPGA
- Main system clock

## Library data of the parts
B1V2 B1V8 B3V3 R1V2 R1V8 R3V3 = _sg_misc:JUMPER2
B_VIO R_VIO = _sg_misc:HEADER_3X2
BTM TOP = con-panduit:057-040-: CONNECTOR 40-pin series 057 contact pc board low profile headers
C1 C2 = _sg_misc:CAP0805
C3-C24 = _sg_lib:CAP0603
CK FLASH_CS FPGA_1V2 FPGA_RST SI SO = _sg_lib:PIN
DONE LEDGRN LEDRED = _sg_lib:LED0603
HS = _sg_lib:DF40_70
JTAG1 = _sg_misc:JTAG-HEADER
L1 L2 L4 L5 = _sg_lib:FERRITE0603
L3 = _sg_misc:L_0805
R1 R2 R5-R11 R_M0 R_M1 = _sg_lib:RES0603
U1 = _sg_lib:SDRAM_256MBIT_TSOP54
U2 = _sg_misc:M25P32_SERIALFLASH
U3 = _sg_lib:VREG_SW_FT440
U4 = _sg_lib:USB3320
U5 = _sg_lib:SPARTAN6-FT256
U6-U9 = _sg_lib:VREG_LDO
U10 = _sg_lib:OSC
USB1 = _sg_lib:USB_MICROB